# EAGLE design 08C-005 (EAGLE 9.6.2)
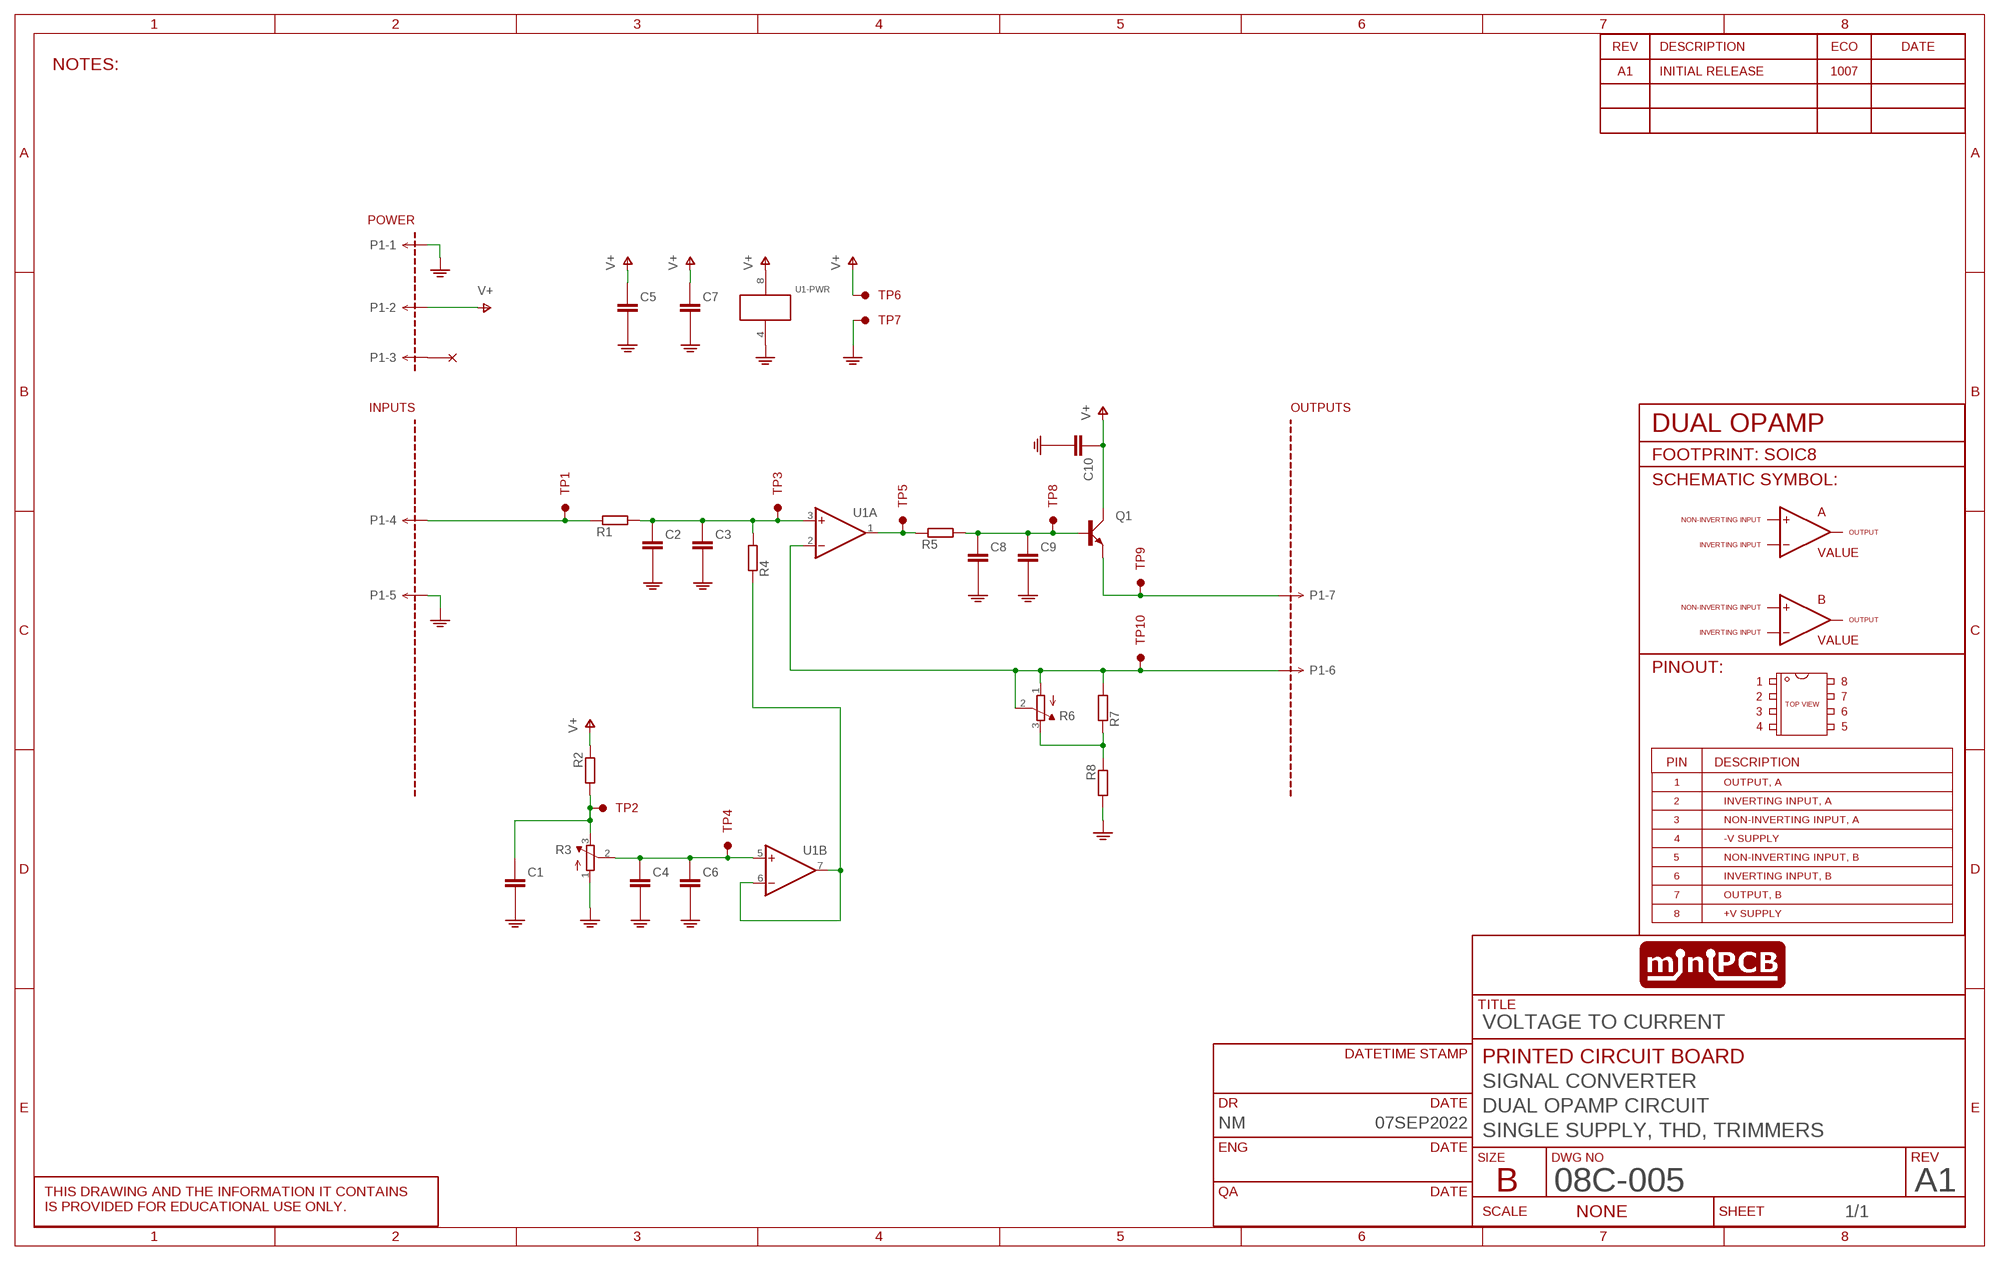
[diagram p0: schematic, sheet 1]
SHEET1 (SCHEMATIC): CIRCUIT_CATEGORY: SIGNAL CONVERTER; CIRCUIT_NAME: DUAL OPAMP CIRCUIT; CIRCUIT_VARIANT: SINGLE SUPPLY, THD, TRIMMERS; DR: NM; DR_DATE: 07SEP2022; PCB_PCBA: PRINTED CIRCUIT BOARD; REVA: A1; REVA_ECO: 1007; REVISION: A1; TITLE: VOLTAGE TO CURRENT

## Parts
C1  CAPACITORTHD  [C050-024X044]
C2  CAPACITORTHD  [C050-024X044]
C3  CAPACITORTHD  [C050-024X044]
C4  CAPACITORTHD  [C050-024X044]
C5  CAPACITORTHD  [C050-024X044]
C6  CAPACITORTHD  [C050-024X044]
C7  CAPACITORTHD  [C050-024X044]
C8  CAPACITORTHD  [C050-024X044]
C9  CAPACITORTHD  [C050-024X044]
C10  CAPACITOR_10  [C5MM]
P1  MINIPCB_7P  [PINS_1X7]
PCB1  MINIPCB_0P50X50  [MINIPCB_0P_50X50MM]
Q1  BJT_NPNEBC  [TO92-EBC-OVAL]
R1  RESISTOR10MM  [0207/10]
R2  RESISTOR10MM  [0207/10]
R3  TRIMPOT0.100THD  [TRIM_0100]
R4  RESISTOR10MM  [0207/10]
R5  RESISTOR10MM  [0207/10]
R6  TRIMPOT0.100THD  [TRIM_0100]
R7  RESISTOR10MM  [0207/10]
R8  RESISTOR10MM  [0207/10]
TP1  TESTPOINTKE5000-SMTEXT  [PINS_1_TESTPOINT_KE5000_NOTEXT]
TP2  TESTPOINTKE5000-SMTEXT  [PINS_1_TESTPOINT_KE5000_NOTEXT]
TP3  TESTPOINTKE5000-SMTEXT  [PINS_1_TESTPOINT_KE5000_NOTEXT]
TP4  TESTPOINTKE5000-SMTEXT  [PINS_1_TESTPOINT_KE5000_NOTEXT]
TP5  TESTPOINTKE5000-SMTEXT  [PINS_1_TESTPOINT_KE5000_NOTEXT]
TP6  TESTPOINTKE5000-SMTEXT  [PINS_1_TESTPOINT_KE5000_NOTEXT]
TP7  TESTPOINTKE5000-SMTEXT  [PINS_1_TESTPOINT_KE5000_NOTEXT]
TP8  TESTPOINTKE5000-SMTEXT  [PINS_1_TESTPOINT_KE5000_NOTEXT]
TP9  TESTPOINTKE5000-SMTEXT  [PINS_1_TESTPOINT_KE5000_NOTEXT]
TP10  TESTPOINTKE5000-SMTEXT  [PINS_1_TESTPOINT_KE5000_NOTEXT]
U1  OPAMP_DUALTHD  [DIL08]

## Nets
BIAS: C4.1(+) C6.1(+) R3.2(S) TP4.1 U1.5(B:+IN)
GND: C1.2(-) C2.2(-) C3.2(-) C4.2(-) C5.2(-) C6.2(-) C7.2(-) C8.2(-) C9.2(-) C10.- P1.1 P1.5 R3.1(A) R8.2 TP7.1 U1.4(-PWR:V-)
IN: R4.1 U1.6(B:-IN) U1.7(B:OUT)
N$1: C2.1(+) C3.1(+) R1.2 R4.2 TP3.1 U1.3(A:+IN)
N$2: P1.4 R1.1 TP1.1
OUT+: P1.7 Q1.E TP9.1
OUT-: P1.6 R6.1(A) R6.2(S) R7.2 TP10.1 U1.2(A:-IN)
Q1.B: C8.1(+) C9.1(+) Q1.B R5.2 TP8.1
R2.3: C1.1(+) R2.2 R3.3(E) TP2.1
R6.3: R6.3(E) R7.1 R8.1
U1.1: R5.1 TP5.1 U1.1(A:OUT)
V+: C5.1(+) C7.1(+) C10.+ P1.2 Q1.C R2.1 TP6.1 U1.8(-PWR:V+)
Unconnected: P1.3

## Notes on the sheet
- NOTES:

## Library data of the parts
C1-C10 = minipcb:CAPACITOR
P1 = minipcb:MINIPCB_7P
PCB1 = minipcb:MINIPCB_0P; CIRCUIT_CATEGORY: SIGNAL CONVERTERS; PART_NUMBER: 08C-005; REVISION: A1-01; TITLE: VOLTAGE TO CURRENT
Q1 = minipcb:BJT_NPN: TRANSISTOR
R1 R2 R4 R5 R7 R8 = minipcb:RESISTOR
R3 R6 = minipcb:TRIMPOT: SMT trimmer potentiometer part number TC33X http://www.ladyada.net/library/eagle
TP1-TP10 = minipcb:TESTPOINT
U1 = minipcb:OPAMP_DUAL: OP AMP

## Board
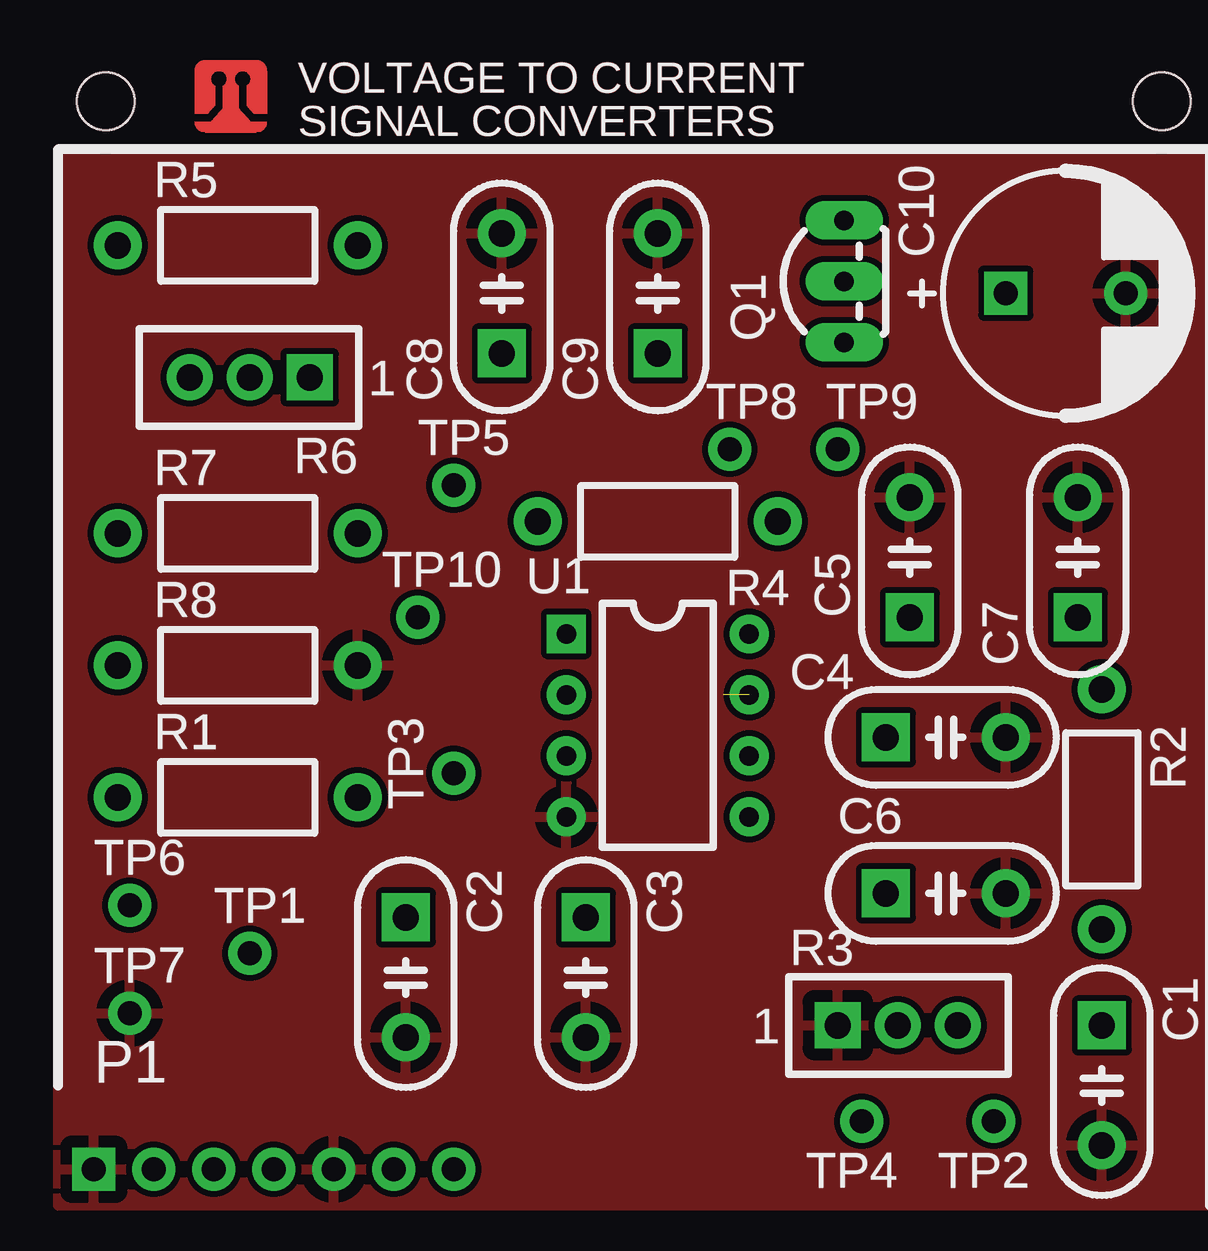
[diagram p1: board, top side]
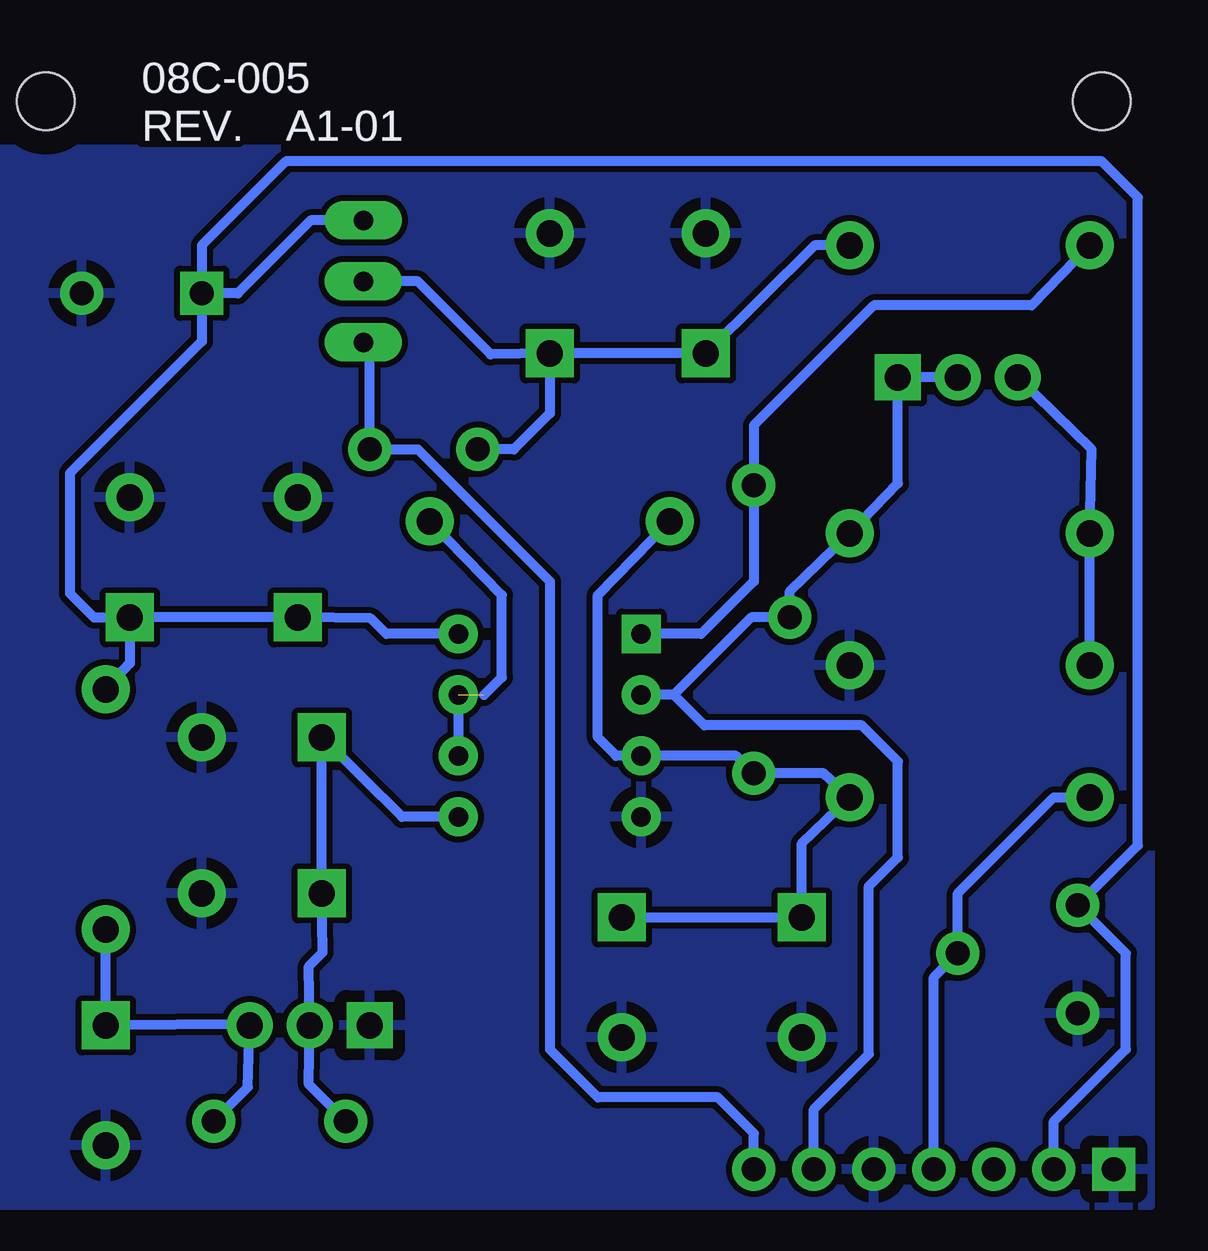
[diagram p2: board, bottom side, seen from below]

No outline drawn. Coordinates in mm, seen from the top.
Copper layers (1*16): Top 0.035mm / dielectric 1.5mm / Bottom 0.035mm
Design rules "minipcb": minimum track width 0.2mm, minimum drill 0.5mm, track to track 0.25mm, track to pad 0.5mm, pad to pad 0.5mm, via to via 0.5mm, smd to smd 0.15mm, copper to edge 1mm, drill to drill 1mm, minimum pad ring 0.4mm, minimum via ring 0.4mm, stop-mask expansion 0.1mm, vias tented up to drill 0.6mm, thermal gap 0.5mm

### Footprints (pad centres in the part's own frame; a part is rotated, then mirrored left to right if it is on the bottom)
C050-024X044 = drill 1.1 pad 2 square: 1 -2.5,0 | drill 1.1 pad 2: 2 2.5,0
C5MM = drill 1 square: + -2.5,0 | drill 1: - 2.5,0
PINS_1X7 = drill 1 square: 1 0,0 | drill 1: 2 2.5,0; 3 5,0; 4 7.5,0; 5 10,0; 6 12.5,0; 7 15,0
MINIPCB_0P_50X50MM = hole 2.4: 47,47; 3,47
TO92-EBC-OVAL = drill 0.813 long: B 0,-1.27; C 2.54,-1.27; E -2.54,-1.27
0207/10 = drill 1.1 pad 2: 1 -5,0; 2 5,0
TRIM_0100 = drill 1.1 pad 1.93 square: 1 0,0 | drill 1.1 pad 1.93: 2 2.5,0; 3 5,0
PINS_1_TESTPOINT_KE5000_NOTEXT = drill 1: 1 0,0
DIL08 = drill 0.813 square: 1 -3.81,-3.81 | drill 0.813: 2 -1.27,-3.81; 3 1.27,-3.81; 4 3.81,-3.81; 5 3.81,3.81; 6 1.27,3.81; 7 -1.27,3.81; 8 -3.81,3.81

### Placement (x,y rotation side)
C1  44.5,6 270 top
C2  15.5,10.5 270 top
C3  23,10.5 270 top
C4  38,20.5 0 top
C5  36.5,28 90 top
C6  38,14 0 top
C7  43.5,28 90 top
C8  19.5,39 90 top
C9  26,39 90 top
C10  43,39 0 top
P1  2.5,2.5 0 top
PCB1  0,0 0 top
Q1  32.5,39.5 90 top
R1  8.5,18 0 top
R2  44.5,17.5 270 top
R3  33.5,8.5 0 top
R4  26,29.5 180 top
R5  8.5,41 0 top
R6  11.5,35.5 180 top
R7  8.5,29 0 top
R8  8.5,23.5 0 top
TP1  9,11.5 0 top
TP2  40,4.5 180 top
TP3  17.5,19 90 top
TP4  34.5,4.5 180 top
TP5  17.5,31 0 top
TP6  4,13.5 0 top
TP7  4,9 0 top
TP8  29,32.5 0 top
TP9  33.5,32.5 0 top
TP10  16,25.5 0 top
U1  26,21 270 top

### Tracks (layer width: path | path; a pad name or v marks a point on that pad's centre or on a via)
BIAS
  Bottom 0.406: TP4.1 36.04,6.04 R3.2 36.04,10.96 35.46,11.54 C6.1 C4.1 32.15,17.19 U1.5
GND
  pour Bottom: 1,1 49,1 49,45 2,45 1,45
  pour Top: 1,1 49,1 49,45 2,45 1,45
IN  (1 unrouted)
  Bottom 0.406: 28.73,22.27 28,23 28,26.42 R4.1 | U1.7 U1.6
N$1
  Bottom 0.406: R4.2 24,26.42 24,20.5 23.23,19.73 U1.3 18.23,19.73 TP3.1 14.58,19 R1.2 15.5,16.08 C2.1 C3.1
N$2
  Bottom 0.406: R1.1 5,18 9,14 TP1.1 10,10.5 P1.4
OUT+
  Bottom 0.406: Q1.E 33.77,36.77 33.5,36.5 TP9.1 31.5,32.5 26,27 26,7.5 24,5.5 19,5.5 17.5,4 P1.7
OUT-
  Bottom 0.406: R6.2 R6.1 11.5,31.08 R7.2 16,26.58 TP10.1 17.6,25.5 20.83,22.27 | 20.83,22.27 U1.2 | 20.53,21.97 19.56,21 13,21 11.5,19.5 11.5,15.5 12.7,14.3 12.7,7.3 15,5 P1.6 | 20.53,21.97 20.83,22.27 | 20.53,21.97
Q1.B
  Bottom 0.406: R5.2 14.96,41 C8.1 C9.1 | C9.1 26,34 27.5,32.5 TP8.1 | C9.1 28.46,36.46 31.5,39.5 Q1.B
R2.3
  Bottom 0.406: TP2.1 38.58,5.92 R3.3 38.62,8.54 C1.1 R2.2
R6.3
  Bottom 0.406: R8.1 R7.1 3.42,32.5 R6.3
U1.1
  Bottom 0.406: R5.1 5.92,38.5 12.5,38.5 17.5,33.5 TP5.1 17.5,27 19.69,24.81 U1.1
V+
  Bottom 0.406: C10.+ 40.5,41 37,44.5 3,44.5 1.5,43 1.5,16 TP6.1 2,11.5 2,7.5 5,4.5 P1.2 | Q1.C 35.96,42.04 39,39 C10.+ | U1.8 32.81,24.81 33.46,25.46 C5.1 C7.1 | C7.1 43.5,23.58 R2.1 | C10.+ 40.5,37 46,31.5 46,26.5 45,25.5 43.54,25.5 C7.1

### Text on the board
_tNames: R5 | C10 | Q1 | C8 | C9 | TP8 | TP9 | R6 | TP5 | R7 | TP10 | R4 | R8 | U1 | C5 | C7 | C4 | R2 | R1 | TP3 | C6 | TP6 | C2 | C3 | TP1 | R3 | C1 | TP7 | TP4 | TP2